# Altium schematic sheet Sheet_1.SchDoc
size 594 x 420 mm; CheckedBy: Аноним А.А.; Author: Шкитун П.А.; CompanyName: ИП Аноним А.А.; SheetNumber: 1; SheetTotal: 2; Name: Wireless Sample; DecimalNumber: Prototype
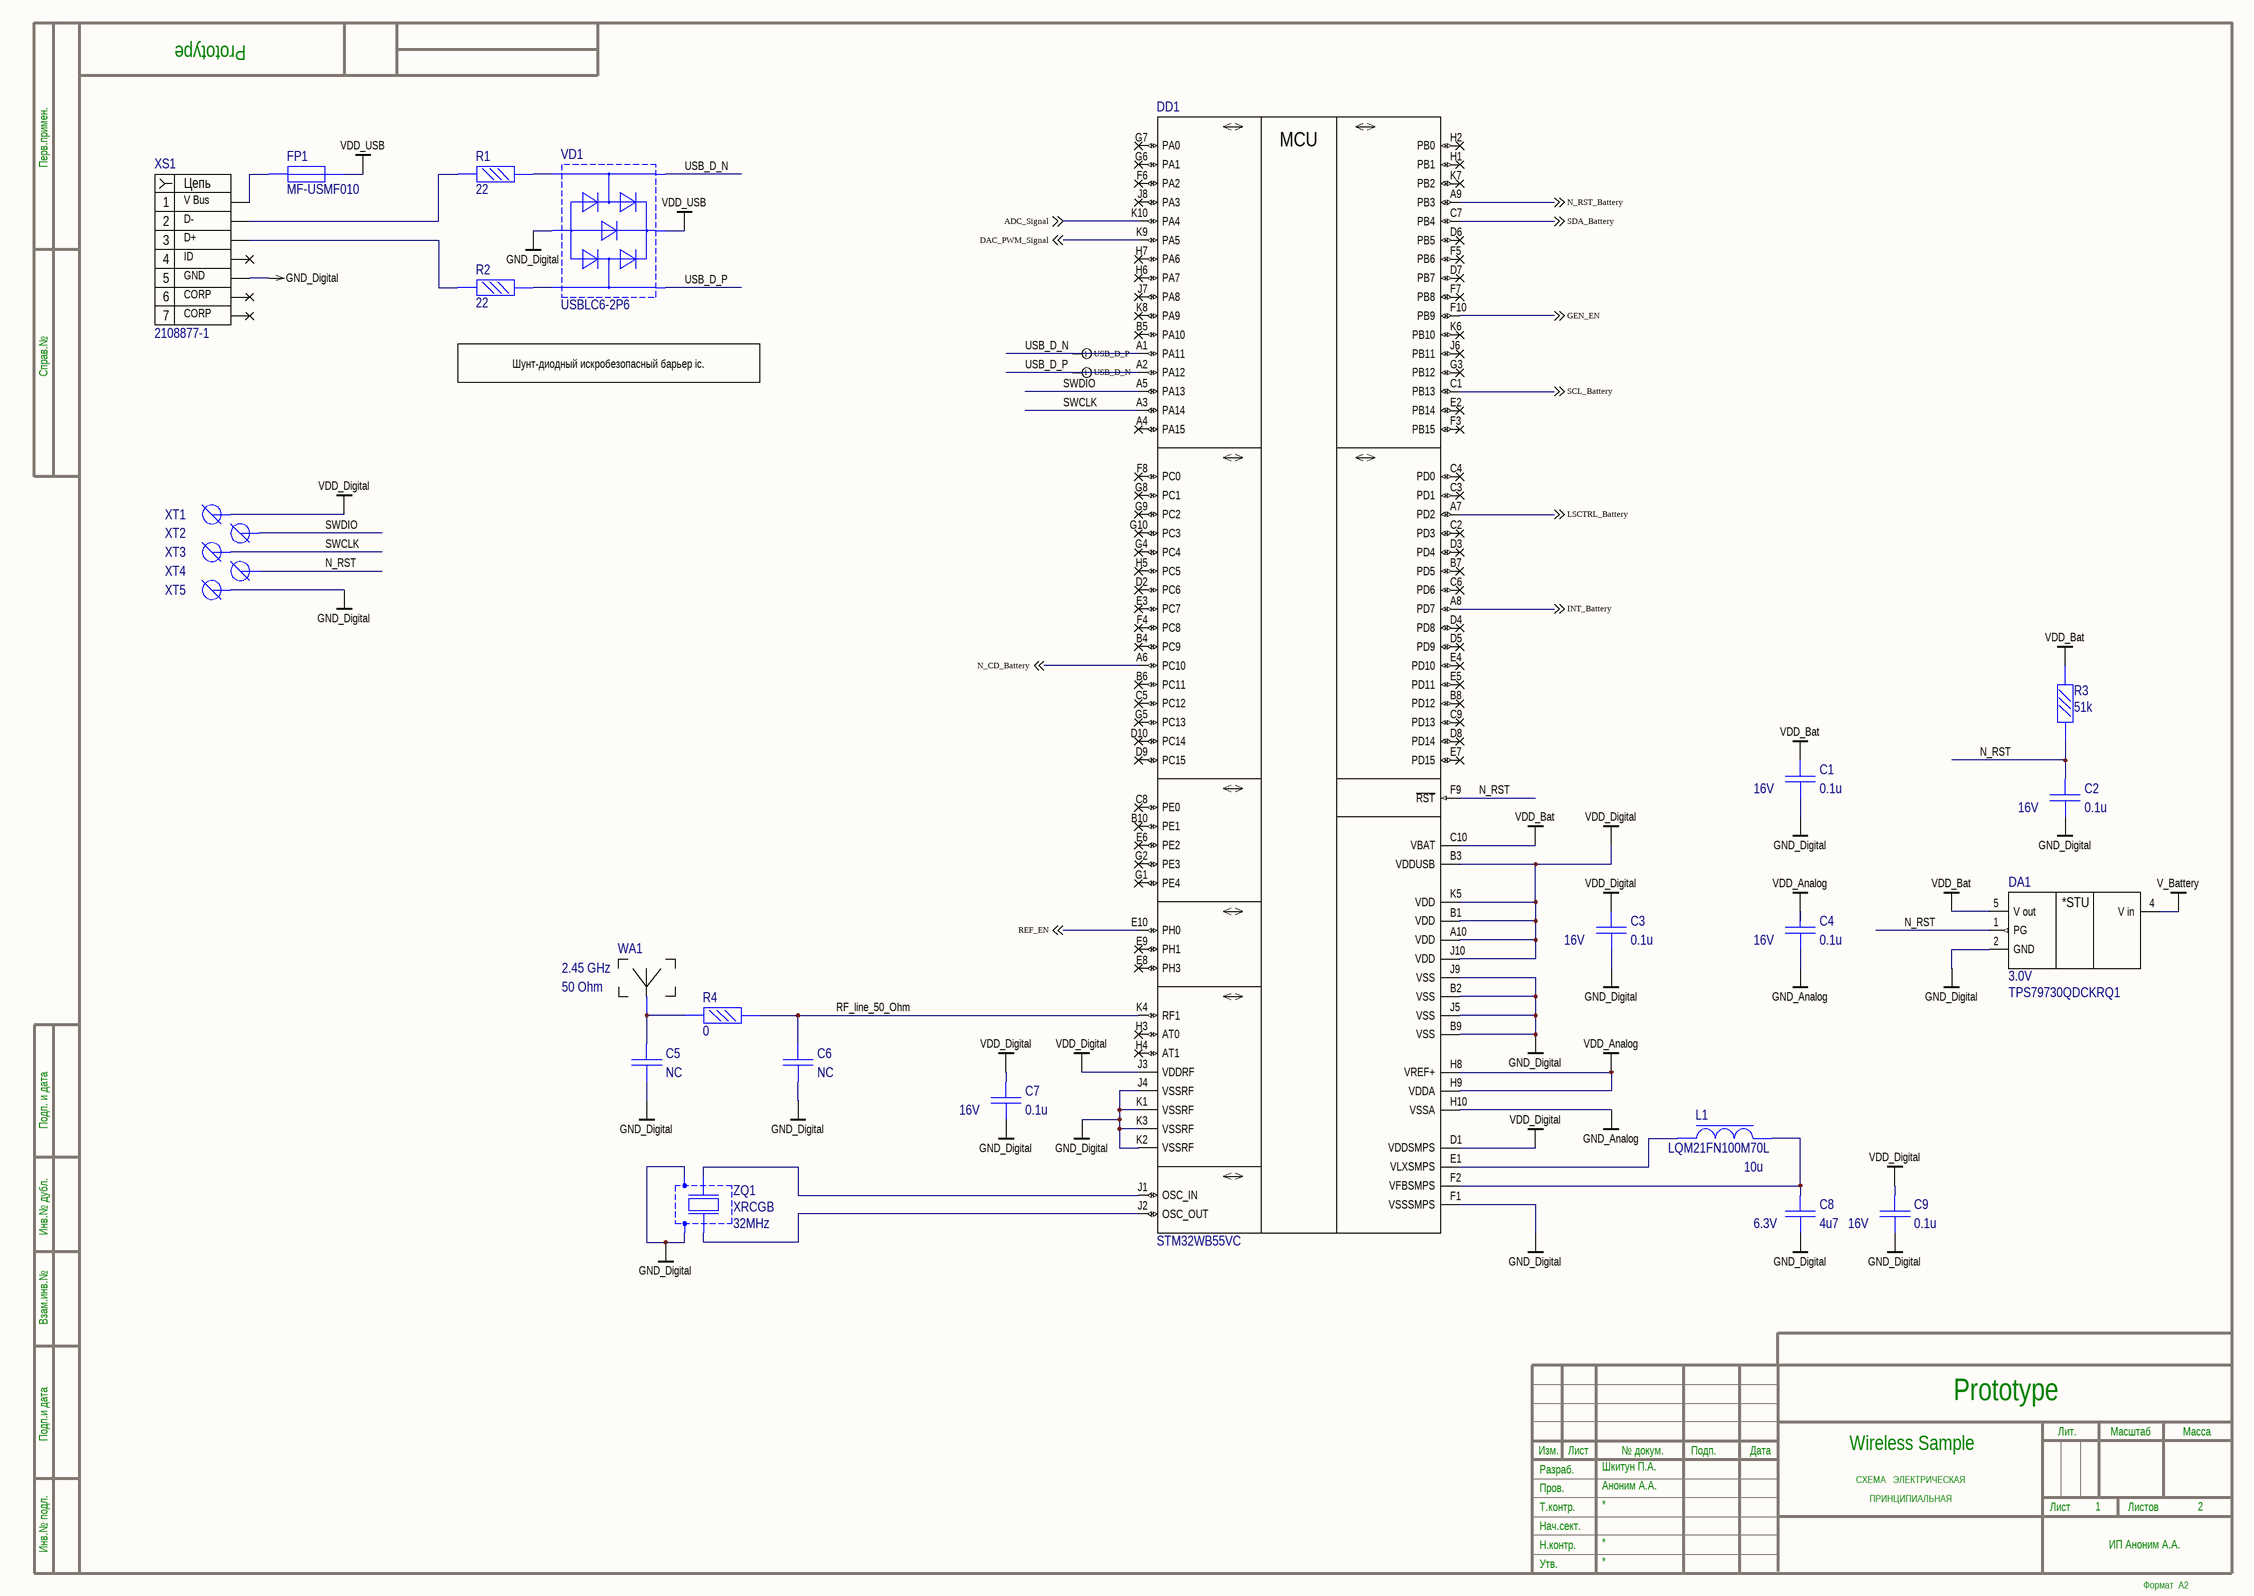
[diagram p0: Sheet_1.SchDoc]

## Parts
C1  value 0.1u  Voltage: 16V  [C0201_2]  (hidden comment: X7R)
C2  value 0.1u  Voltage: 16V  [C0201_2]  (hidden comment: X7R)
C3  value 0.1u  Voltage: 16V  [C0201_2]  (hidden comment: X7R)
C4  value 0.1u  Voltage: 16V  [C0201_2]  (hidden comment: X7R)
C5  value NC  [C0201_C0G]  (hidden comment: C0G)
C6  value NC  [C0201_C0G]  (hidden comment: C0G)
C7  value 0.1u  Voltage: 16V  [C0201_2]  (hidden comment: X7R)
C8  value 4u7  Voltage: 6.3V  [C0603]  (hidden comment: X7R)
C9  value 0.1u  Voltage: 16V  [C0201_2]  (hidden comment: X7R)
DA1  value 3.0V  [SC70-5]  (hidden comment: TPS79730QDCKRQ1)
DD1  STM32WB55VC  [WLCSP-100]
FP1  value MF-USMF010  [F1210]  (hidden comment: MF-USM005)
L1  value 10u  [L0805]  (hidden comment: LQM21FN100M70L)
R1  value 22  [R0201_2]  (hidden comment: ERJ1GN)
R2  value 22  [R0201_2]  (hidden comment: ERJ1GN)
R3  value 51k  [R0201_2]  (hidden comment: ERJ1GN)
R4  value 0  [R0201_2]  (hidden comment: ERJ1GN)
VD1  USBLC6-2P6  [SOT-666]
WA1  value 2.45 GHz  Z: 50 Ohm  [AMCA31-2R450G-S1F-T3]  (hidden comment: X7R)
XS1  value 2108877-1  7_line: CORP  1_line: V Bus  2_line: D-  3_line: D+  4_line: ID  5_line: GND  [2108877-1]  (hidden comment: 2108877-1 TE Connectivity)
XT1  Test_Pin  [TEST_PIN_2]  (value not drawn)
XT2  Test_Pin  [TEST_PIN_2]  (value not drawn)
XT3  Test_Pin  [TEST_PIN_2]  (value not drawn)
XT4  Test_Pin  [TEST_PIN_2]  (value not drawn)
XT5  Test_Pin  [TEST_PIN_2]  (value not drawn)
ZQ1  value 32MHz  [XRCGB]  (hidden comment: XRCGB)

## Nets
GND_Analog: C4.2 DD1.H10(VSSA)
GND_Digital: C1.2 C2.2 C3.2 C5.2 C6.2 C7.2 C8.2 C9.2 DA1.2(GND) DD1.B2(VSS) DD1.B9(VSS) DD1.F1(VSSSMPS) DD1.J4(VSSRF) DD1.J5(VSS) DD1.J9(VSS) DD1.K1(VSSRF) DD1.K2(VSSRF) DD1.K3(VSSRF) VD1.2(GND) XS1.5(GND) XT5.1 ZQ1.2 ZQ1.4
V_Battery: DA1.4(V_in)
VDD_Analog: C4.1 DD1.H8(VREF+) DD1.H9(VDDA)
VDD_Bat: C1.1 DA1.5(V_out) DD1.C10(VBAT) R3.2
VDD_Digital: C3.1 C7.1 C9.1 DD1.A10(VDD) DD1.B1(VDD) DD1.B3(VDDUSB) DD1.D1(VDDSMPS) DD1.J3(VDDRF) DD1.J10(VDD) DD1.K5(VDD) XT1.1
VDD_USB: FP1.2 VD1.5(V_bus)
ADC_Signal: DD1.K10(PA4) ; off-sheet ADC_Signal
DAC_PWM_Signal: DD1.K9(PA5) ; off-sheet DAC_PWM_Signal
GEN_EN: DD1.F10(PB9) ; off-sheet GEN_EN
INT_Battery: DD1.A8(PD7) ; off-sheet INT_Battery
LSCTRL_Battery: DD1.A7(PD2) ; off-sheet LSCTRL_Battery
N_CD_Battery: DD1.A6(PC10) ; off-sheet N_CD_Battery
N_RST: C2.1 DA1.1(PG) DD1.F9(~{RST}) R3.1 XT4.1
N_RST_Battery: DD1.A9(PB3) ; off-sheet N_RST_Battery
REF_EN: DD1.E10(PH0) ; off-sheet REF_EN
RF_line_50_Ohm: C6.1 DD1.K4(RF1) R4.2
SCL_Battery: DD1.C1(PB13) ; off-sheet SCL_Battery
SDA_Battery: DD1.C7(PB4) ; off-sheet SDA_Battery
SWCLK: DD1.A3(PA14) XT3.1
SWDIO: DD1.A5(PA13) XT2.1
USB_D_N: DD1.A1(PA11) VD1.4(IO_21)
USB_D_P: DD1.A2(PA12) VD1.6(IO_11)
NetC5_1: C5.1 R4.1 WA1.1
NetC8_1: C8.1 DD1.F2(VFBSMPS) L1.2
NetDD1_E1: DD1.E1(VLXSMPS) L1.1
NetDD1_J1: DD1.J1(OSC_IN) ZQ1.3
NetDD1_J2: DD1.J2(OSC_OUT) ZQ1.1
NetFP1_1: FP1.1 XS1.1(V_bus)
NetR1_1: R1.1 XS1.2(D-)
NetR1_2: R1.2 VD1.3(IO_20)
NetR2_1: R2.1 XS1.3(D+)
NetR2_2: R2.2 VD1.1(IO_10)

Not connected (* = marked no-connect by the designer): DD1 A4(PA15)* B4(PC9)* B5(PA10)* B6(PC11)* B7(PD5)* B8(PD12)* B10(PE1)* C2(PD3)* C3(PD1)* C4(PD0)* C5(PC12)* C6(PD6)* C8(PE0)* C9(PD13)* D2(PC6)* D3(PD4)* D4(PD8)* D5(PD9)* D6(PB5)* D7(PB7)* D8(PD14)* D9(PC15)* D10(PC14)* E2(PB14)* E3(PC7)* E4(PD10)* E5(PD11)* E6(PE2)* E7(PD15)* E8(PH3)* E9(PH1)* F3(PB15)* F4(PC8)* F5(PB6)* F6(PA2)* F7(PB8)* F8(PC0)* G1(PE4)* G2(PE3)* G3(PB12)* G4(PC4)* G5(PC13)* G6(PA1)* G7(PA0)* G8(PC1)* G9(PC2)* G10(PC3)* H1(PB1)* H2(PB0)* H3(AT0)* H4(AT1)* H5(PC5)* H6(PA7)* H7(PA6)* J6(PB11)* J7(PA8)* J8(PA3)* K6(PB10)* K7(PB2)* K8(PA9)*; XS1 4(NC)* 6(Corp_1)* 7(Corp_2)*

## Layout directives
differential pair: USB_D_N, USB_D_P

## Notes on the sheet
- Шунт-диодный искробезопасный барьер ic.
- Перв.примен.
- Справ.№
- Подп. и дата
- Инв.№ дубл.
- Взам.инв.№
- Подп.и дата
- Разраб.
- Изм.
- Лист
- № докум.
- Подп.
- Дата
- Лит.
- Масштаб
- Масса
- Т.контр.
- Пров.
- СХЕМА   ЭЛЕКТРИЧЕСКАЯ
- ПРИНЦИПИАЛЬНАЯ
- Листов
- Инв.№ подл.
- Утв.
- Н.контр.
- Нач.сект.
- Формат  A2
- (in symbol 2108877-1) Цепь
- (in symbol STM32WB55VC) MCU
- (in symbol TPS79730QDCKRQ1) *STU

## Library data of the parts
C1-C4 C7 C9 = X7R C0201: Type: Конденсатор; Published: 18.05.2010; Publisher: Andrew Danich
C5 C6 = C0G C0201: Type: Конденсатор; Published: 18.05.2010; Publisher: Andrew Danich
C8 = X7R C0603: Type: Конденсатор; Published: 18.05.2010; Publisher: Andrew Danich
L1 = LQM21FN100M70L: Type: Дроссель; Published: 20.05.2010; Publisher: Andrew Danich; Name: LQM21FN100M70L
R1-R4 = R0201: Published: 19.09.2014; Publisher: Andrew Danich; Type: Резистор
VD1 = USBLC6-2P6: Type: Сборка диодная; Published: 08.07.2014; Publisher: Andrew Danich; Value: USBLC6-2P6
WA1 = AMCA31-2R450G-S1F-T3: Published: 18.05.2010; Publisher: Andrew Danich; Type: Конденсатор
XS1 = 2108877-1: Published: 07.03.2013; Publisher: Andrew Danich; Type: Розетка; 6_line: CORP
DA1 = TPS79730QDCKRQ1: Published: 21.01.2015; Publisher: Andrew Danich; Type: Микросхема; Name: TPS79730QDCKRQ1
DD1 = STM32WB55VC: Published: 16.10.2015; Publisher: Andrew Danich; Type: Микросхема; Value: STM32WB55VC
FP1 = MF-USM005: Published: 24.09.2010; Publisher: Andrew Danich; Type: Вставка плавкая
XT1-XT5 = Test_Pin: Published: 07.03.2013; Publisher: Andrew Danich; Type: Розетка
ZQ1 = XRCGB: Published: 27.08.2015; Publisher: Andrew Danich; Type: Резонатор; Model: XRCGB